# Altium schematic sheet INPUT_POWER.SchDoc
size A4; SheetNumber: 1; SheetTotal: 5
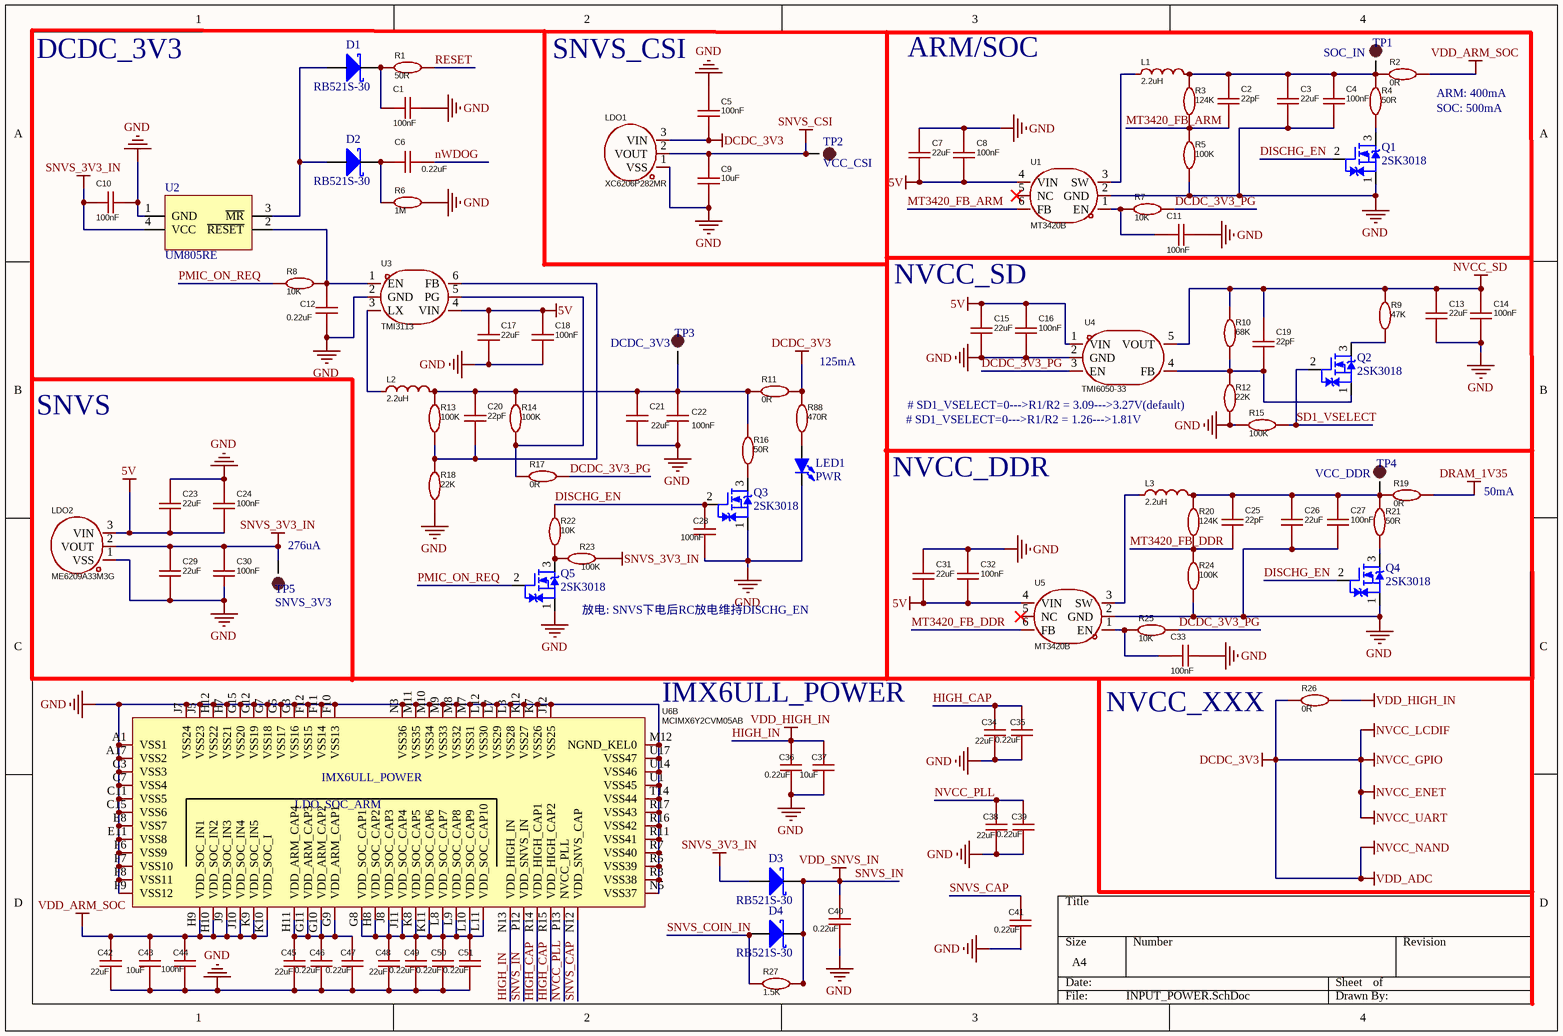
[diagram p0: INPUT_POWER.SchDoc]

## Parts
C1  100nF  [C0402]
C2  22pF  [C0402]
C3  22uF  [C0603]
C4  100nF  [C0402]
C5  100nF  [C0402]
C6  0.22uF  [C0402]
C7  22uF  [C0603]
C8  100nF  [C0402]
C9  10uF  [C0402]
C10  100nF  [C0402]
C11  100nF  [C0402]
C12  0.22uF  [C0402]
C13  22uF  [C0603]
C14  100nF  [C0402]
C15  22uF  [C0603]
C16  100nF  [C0402]
C17  22uF  [C0603]
C18  100nF  [C0402]
C19  22pF  [C0402]
C20  22pF  [C0402]
C21  22uF  [C0603]
C22  100nF  [C0402]
C23  22uF  [C0603]
C24  100nF  [C0402]
C25  22pF  [C0402]
C26  22uF  [C0603]
C27  100nF  [C0402]
C28  100nF  [C0402]
C29  22uF  [C0603]
C30  100nF  [C0402]
C31  22uF  [C0603]
C32  100nF  [C0402]
C33  100nF  [C0402]
C34  22uF  [C0603]
C35  0.22uF  [C0402]
C36  0.22uF  [C0402]
C37  10uF  [C0402]
C38  22uF  [C0603]
C39  0.22uF  [C0402]
C40  0.22uF  [C0402]
C41  0.22uF  [C0402]
C42  22uF  [C0603]
C43  10uF  [C0402]
C44  100nF  [C0402]
C45  22uF  [C0603]
C46  0.22uF  [C0402]
C47  0.22uF  [C0402]
C48  22uF  [C0603]
C49  0.22uF  [C0402]
C50  0.22uF  [C0402]
C51  0.22uF  [C0402]
D1  RB521S-30  [SOD-523]
D2  RB521S-30  [SOD-523]
D3  RB521S-30  [SOD-523]
D4  RB521S-30  [SOD-523]
L1  2.2uH  [IND-SMD_L2.5-W2.0_MHCHL2520]
L2  2.2uH  [IND-SMD_L2.5-W2.0_MHCHL2520]
L3  2.2uH  [IND-SMD_L2.5-W2.0_MHCHL2520]
LDO1  XC6206P282MR  [SOT-23-3_L2.9-W1.6-P1.90-LS2.8-BR]
LDO2  ME6209A33M3G  [SOT-23-3_L2.9-W1.6-P1.90-LS2.8-BR]
LED1  PWR  [LED 0603B]
Q1  2SK3018  [SC70-3N]
Q2  2SK3018  [SC70-3N]
Q3  2SK3018  [SC70-3N]
Q4  2SK3018  [SC70-3N]
Q5  2SK3018  [SC70-3N]
R1  50R  [R0402]
R2  0R  [R0402]
R3  124K  [R0402]
R4  50R  [R0402]
R5  100K  [R0402]
R6  1M  [R0402]
R7  10K  [R0402]
R8  10K  [R0402]
R9  47K  [R0402]
R10  68K  [R0402]
R11  0R  [R0402]
R12  22K  [R0402]
R13  100K  [R0402]
R14  100K  [R0402]
R15  100K  [R0402]
R16  50R  [R0402]
R17  0R  [R0402]
R18  22K  [R0402]
R19  0R  [R0402]
R20  124K  [R0402]
R21  50R  [R0402]
R22  10K  [R0402]
R23  100K  [R0402]
R24  100K  [R0402]
R25  10K  [R0402]
R26  0R  [R0402]
R27  1.5K  [R0402]
R88  470R  [R0402]
TP1  SOC_IN  [TP-1.0]
TP2  VCC_CSI  [TP-1.0]
TP3  DCDC_3V3  [TP-1.0]
TP4  VCC_DDR  [TP-1.0]
TP5  SNVS_3V3  [TP-1.0]
U1  MT3420B  [SOT-23-6_L2.9-W1.6-P0.95-LS2.8-BL]
U2  UM805RE  [SOT143]
U3  TMI3113  [SOT-23-6_L2.9-W1.6-P0.95-LS2.8-BL]
U4  TMI6050-33  [SOT-23-5_L2.9-W1.6-P0.95-LS2.8-BR]
U5  MT3420B  [SOT-23-6_L2.9-W1.6-P0.95-LS2.8-BL]
U6  MCIMX6Y2CVM05AB  [BGA-289_L14.0-W14.0-R17-C17-P0.80-BL]  (part B of 12)

## Nets
5V: C7.1 C8.1 C15.2 C16.2 C17.2 C18.2 C23.1 C24.1 C31.1 C32.1 LDO2.3(VIN) U1.4(VIN) U3.4(VIN) U4.1(VIN) U5.4(VIN)
DCDC_3V3: C5.2 LDO1.3(VIN) R11.2 R26.1 R88.2  [also labelled NVCC_ENET, NVCC_GPIO, NVCC_LCDIF, NVCC_NAND, NVCC_UART, VDD_ADC]
DRAM_1V35: R19.2
GND: C1.1 C3.1 C4.1 C5.1 C7.2 C8.2 C9.1 C10.1 C11.1 C12.2 C13.1 C14.1 C15.1 C16.1 C17.1 C18.1 C21.1 C22.1 C23.2 C24.2 C26.1 C27.1 C28.1 C29.1 C30.1 C31.2 C32.2 C33.1 C34.1 C35.1 C36.1 C37.1 C38.1 C39.1 C40.1 C41.1 C42.1 C43.1 C44.1 C45.1 C46.1 C47.1 C48.1 C49.1 C50.1 C51.1 LDO1.1(VSS) LDO2.1(VSS) LED1.2(K) Q1.1(S) Q3.1(S) Q4.1(S) Q5.1(S) R5.2 R6.2 R12.2 R15.1 R18.1 R24.2 U1.2(GND) U2.1(GND) U3.2(GND) U4.2(GND) U5.2(GND) U6.A1(VSS1) U6.A17(VSS2) U6.C3(VSS3) U6.C7(VSS4) U6.C11(VSS5) U6.C15(VSS6) U6.E8(VSS7) U6.E11(VSS8) U6.F6(VSS9) U6.F7(VSS10) U6.F8(VSS11) U6.F9(VSS12) U6.F10(VSS13) U6.F11(VSS14) U6.F12(VSS15) U6.G3(VSS16) U6.G5(VSS17) U6.G7(VSS18) U6.G12(VSS19) U6.G15(VSS20) U6.H7(VSS21) U6.H12(VSS22) U6.J5(VSS23) U6.J7(VSS24) U6.J12(VSS25) U6.K7(VSS26) U6.K12(VSS27) U6.L3(VSS28) U6.L7(VSS29) U6.L12(VSS30) U6.M7(VSS31) U6.M8(VSS32) U6.M9(VSS33) U6.M10(VSS34) U6.M11(VSS35) U6.M12(NGND_KEL0) U6.N3(VSS36) U6.N5(VSS37) U6.R3(VSS38) U6.R5(VSS39) U6.R7(VSS40) U6.R11(VSS41) U6.R16(VSS42) U6.R17(VSS43) U6.T14(VSS44) U6.U1(VSS45) U6.U14(VSS46) U6.U17(VSS47)
HIGH_IN: C36.2 C37.2 R26.2 U6.N13(VDD_HIGH_IN)  [also labelled VDD_HIGH_IN]
NVCC_SD: C13.2 C14.2 C19.2 R9.2 R10.1 U4.5(VOUT)
SNVS_3V3_IN: C10.2 C29.2 C30.2 D3.1(A) LDO2.2(VOUT) R23.1 TP5.1 U2.4(VCC)
SNVS_CSI: C9.2 LDO1.2(VOUT) TP2.1
SNVS_IN: C40.2 D3.2(C) D4.2(C) R27.1 U6.P12(VDD_SNVS_IN)  [also labelled VDD_SNVS_IN]
VDD_ARM_SOC: C42.2 C43.2 C44.2 R2.2 U6.H9(VDD_SOC_IN1) U6.H10(VDD_SOC_IN2) U6.J9(VDD_SOC_IN3) U6.J10(VDD_SOC_IN4) U6.K9(VDD_SOC_IN5) U6.K10(VDD_SOC_I)
DCDC_3V3_PG: R7.1 R17.2 R25.1 U4.3(EN)
DISCHG_EN: C28.2 Q1.2(G) Q3.2(G) Q4.2(G) R22.2
HIGH_CAP: C34.2 C35.2 U6.R14(VDD_HIGH_CAP1) U6.R15(VDD_HIGH_CAP2)
MT3420_FB_ARM: C2.1 R3.2 R5.1 U1.6(FB)
MT3420_FB_DDR: C25.1 R20.2 R24.1 U5.6(FB)
NVCC_PLL: C38.2 C39.2 U6.P13(NVCC_PLL)
nWDOG: C6.1
PMIC_ON_REQ: Q5.2(G) R8.1
RESET: R1.2
SD1_VSELECT: Q2.2(G) R15.2
SNVS_CAP: C41.2 U6.N12(VDD_SNVS_CAP)
SNVS_COIN_IN: D4.1(A) R27.2
NetC1_2: C1.2 D1.2(C) R1.1
NetC2_2: C2.2 C3.2 C4.2 L1.2 R2.1 R3.1 R4.2 TP1.1
NetC6_2: C6.2 D2.2(C) R6.1
NetC11_2: C11.2 R7.2 U1.1(EN)
NetC12_1: C12.1 R8.2 U2.2(~{RESET}) U3.1(EN)
NetC19_1: C19.1 Q2.1(S) R10.2 R12.1 U4.4(FB)
NetC20_1: C20.1 C21.2 C22.2 L2.2 R11.1 R13.2 R14.1 R16.2 TP3.1
NetC20_2: C20.2 R13.1 R18.2 U3.6(FB)
NetC25_2: C25.2 C26.2 C27.2 L3.2 R19.1 R20.1 R21.2 TP4.1
NetC33_2: C33.2 R25.2 U5.1(EN)
NetC45_2: C45.2 C46.2 C47.2 U6.G9(VDD_ARM_CAP1) U6.G10(VDD_ARM_CAP2) U6.G11(VDD_ARM_CAP3) U6.H11(VDD_ARM_CAP4)
NetC48_2: C48.2 C49.2 C50.2 C51.2 U6.G8(VDD_SOC_CAP1) U6.H8(VDD_SOC_CAP2) U6.J8(VDD_SOC_CAP3) U6.J11(VDD_SOC_CAP4) U6.K8(VDD_SOC_CAP5) U6.K11(VDD_SOC_CAP6) U6.L8(VDD_SOC_CAP7) U6.L9(VDD_SOC_CAP8) U6.L10(VDD_SOC_CAP9) U6.L11(VDD_SOC_CAP10)
NetD1_1: D1.1(A) D2.1(A) U2.3(~{MR})
NetL1_1: L1.1 U1.3(SW)
NetL2_1: L2.1 U3.3(LX)
NetL3_1: L3.1 U5.3(SW)
NetLED1_1: LED1.1(A) R88.1
NetQ1_3: Q1.3(D) R4.1
NetQ2_3: Q2.3(D) R9.1
NetQ3_3: Q3.3(D) R16.1
NetQ4_3: Q4.3(D) R21.1
NetQ5_3: Q5.3(D) R22.1 R23.2
NetR14_2: R14.2 R17.1 U3.5(PG)

Not connected (* = marked no-connect by the designer): U1 5(NC)*; U5 5(NC)*

## Notes on the sheet
- DCDC_3V3
- SNVS_CSI
- ARM/SOC
- (near R2) ARM: 400mA
- (near R2) SOC: 500mA
- NVCC_SD
- 125mA
- SNVS
- # SD1_VSELECT=0--->R1/R2 = 1.26--->1.81V
- # SD1_VSELECT=0--->R1/R2 = 3.09--->3.27V(default)
- NVCC_DDR
- 50mA
- (near TP5) 276uA
- (near Q5) 放电: SNVS下电后RC放电维持DISCHG_EN
- (near U6) IMX6ULL_POWER
- (near C33) NVCC_XXX
- (in symbol MCIMX6Y2CVM05AB, part B) IMX6ULL_POWER; LDO_SOC_ARM

## Library data of the parts
C1 C4 C5 C8 C10 C11 C14 C16 C18 C22 C24 C27 C28 C30 C32 C33 C44 = C0402: 容值:100nF;精度:±10%;额定电压:50V;材质(温度系数):X7R;; Manufacturer: muRata(村田); Symbol: GRM155R71H104KE14D; Add into BOM: yes; Tolerance: ±10%; Voltage Rated: 50V; Temperature Coefficient: X7R; Device: GRM155R71H104KE14D; LCSC Part Name: 100nF ±10% 50V; Supplier Part: C77020; Manufacturer Part: GRM155R71H104KE14D; Supplier Footprint: 0402; JLCPCB Part Class: 扩展库; Datasheet: https://atta.szlcsc.com/upload/public/pdf/source/20180326/C77020_39BD49C951FF1AF0DB1F1FAC5AC1E401.pdf; Supplier: LCSC; Convert to PCB: yes; Value: 100nF
C2 C6 C9 C12 C19 C20 C25 C35-C37 C39-C41 C43 C46 C47 C49-C51 = C0402: 容值:100nF;精度:±10%;额定电压:50V;材质(温度系数):X7R;; Manufacturer: muRata(村田); Symbol: GRM155R71H104KE14D; Add into BOM: yes; Value: 100nF; Tolerance: ±10%; Voltage Rated: 50V; Temperature Coefficient: X7R; Device: GRM155R71H104KE14D; LCSC Part Name: 100nF ±10% 50V; Supplier Part: C77020; Manufacturer Part: GRM155R71H104KE14D; Supplier Footprint: 0402; JLCPCB Part Class: 扩展库; Datasheet: https://atta.szlcsc.com/upload/public/pdf/source/20180326/C77020_39BD49C951FF1AF0DB1F1FAC5AC1E401.pdf; Supplier: LCSC; Convert to PCB: yes
C3 C7 C13 C15 C17 C21 C23 C26 C29 C31 C34 C38 C42 C45 C48 = C0603: 容值:22uF;精度:±20%;额定电压:10V;材质(温度系数):X5R;; Manufacturer: Chinocera(华瓷); Symbol: HGC0603R5226M100NTHJ; Add into BOM: yes; Tolerance: ±20%; Voltage Rated: 10V; Temperature Coefficient: X5R; Device: HGC0603R5226M100NTHJ; LCSC Part Name: 22uF ±20% 10V; Supplier Part: C7432770; Manufacturer Part: HGC0603R5226M100NTHJ; Supplier Footprint: 0603; JLCPCB Part Class: 扩展库; Datasheet: https://atta.szlcsc.com/upload/public/pdf/source/20240320/FAC3FEC40A78BC5CCCE96C232A94D860.pdf; Supplier: LCSC; Convert to PCB: yes; Value: 22uF
L1-L3 = L2.5_SMD: 电感值:2.2uH;精度:±20%;额定电流:3A;饱和电流(Isat):3.8A;类型:一体成型电感;; Manufacturer: cjiang(长江微电); Symbol: FTC252012S2R2MBCA; Add into BOM: yes; Tolerance: ±20%; Rated Current: 3A; Saturation Current (Isat): 3.8A; DC Resistance (DCR): 55mΩ; Type: 一体成型电感; Device: FTC252012S2R2MBCA; LCSC Part Name: 2.2uH ±20% 3.8A; Supplier Part: C5832372; Manufacturer Part: FTC252012S2R2MBCA; Supplier Footprint: 1008; JLCPCB Part Class: 扩展库; Datasheet: https://atta.szlcsc.com/upload/public/pdf/source/20230602/8FFEDA9C0247A92A0D4B67554BFE4091.pdf; Supplier: LCSC; Convert to PCB: yes; Value: 2.2uH
LDO1 = XC6206P282MR: 输出类型:固定;最大输入电压:6V;输出电压:3.3V;最大输出电流:250mA;电源纹波抑制比(PSRR):-;输出极性:正极;; Manufacturer: MICRONE(南京微盟); Symbol: ME6209A33M3G; Add into BOM: yes; Output Type: 固定; Maximum Input Voltage: 18V; Output Voltage: 3.3V; MAX Output Current: 250mA; Dropout Voltage: 80mV@(40mA); Output Polarity: 正极; Number of Outputs: 1; Device: ME6209A33M3G; LCSC Part Name: 输入18V 输出3.3V 250mA; Supplier Part: C83508; Manufacturer Part: ME6209A33M3G; Supplier Footprint: SOT-23-3L; JLCPCB Part Class: 扩展库; Datasheet: https://atta.szlcsc.com/upload/public/pdf/source/20161212/1481539101152.pdf; Supplier: LCSC; Convert to PCB: yes; Power Supply Rejection Ratio (PSRR): -
LDO2 = ME6209A33M3G: 输出类型:固定;最大输入电压:18V;输出电压:3.3V;最大输出电流:250mA;电源纹波抑制比(PSRR):-;输出极性:正极;; Manufacturer: MICRONE(南京微盟); Add into BOM: yes; Output Type: 固定; Maximum Input Voltage: 18V; Output Voltage: 3.3V; MAX Output Current: 250mA; Dropout Voltage: 80mV@(40mA); Output Polarity: 正极; Number of Outputs: 1; Symbol: ME6209A33M3G; Device: ME6209A33M3G; LCSC Part Name: 输入18V 输出3.3V 250mA; Supplier Part: C83508; Manufacturer Part: ME6209A33M3G; Supplier Footprint: SOT-23-3L; JLCPCB Part Class: 扩展库; Datasheet: https://atta.szlcsc.com/upload/public/pdf/source/20161212/1481539101152.pdf; Supplier: LCSC; Convert to PCB: yes; Power Supply Rejection Ratio (PSRR): -
LED1 = LED-SMD: 贴片LED; 版权归属: 源创客; BOM名称: 贴片LED; 学习资源: www.ooocke.com
Q1-Q5 = 2SK3018: N沟场效应管  30V,0.1A; 版权归属: 源创客; BOM名称: N沟场效应管; 学习资源: www.ooocke.com
R1-R27 R88 = R0402: 电阻类型:厚膜电阻;阻值:1kΩ;精度:±1%;功率:62.5mW;最大工作电压:50V;温度系数:±100ppm/℃;; Manufacturer: UNI-ROYAL(厚声); Symbol: 0402WGF1001TCE; Add into BOM: yes; Value: 1kΩ; Tolerance: ±1%; Power(Watts): 62.5mW; Overload Voltage (Max): 50V; Device: 0402WGF1001TCE; LCSC Part Name: 1kΩ ±1% 62.5mW 厚膜电阻; Supplier Part: C11702; Manufacturer Part: 0402WGF1001TCE; Supplier Footprint: 0402; JLCPCB Part Class: 基础库; Datasheet: https://atta.szlcsc.com/upload/public/pdf/source/20200306/C422600_1E6D84923E4A46A82E41ADD87F860B5C.pdf; Supplier: LCSC; Convert to PCB: yes; Type: 厚膜电阻; Temperature Coefficient: ±100ppm/℃; Operating Temperature Range: -55℃~+155℃
TP1-TP5 = TEST-POINT: 测试点
U1 U5 = MT3420B: 功能类型:降压型;输出类型:可调;输入电压:2.3V~6V;输出电流:2A;; Manufacturer: 西安航天民芯; Add into BOM: yes; Function: 降压型; Output Type: 可调; Output Current: 2A; Switching Frequency: 1.5MHz; Synchronous Rectification: 是; Number of Outputs: 1; Topology: 降压式; Quiescent Current (Iq): 40uA; Switch tube (built-in/external): 内置; Symbol: MT3420B; Device: MT3420B; LCSC Part Name: 高效率1.5MHz 2A同步降压转换器; Supplier Part: C88169; Manufacturer Part: MT3420B; Supplier Footprint: SOT-23-6; JLCPCB Part Class: 扩展库; Datasheet: https://atta.szlcsc.com/upload/public/pdf/source/20161118/1479432899451.pdf; Supplier: LCSC; Convert to PCB: yes; Input Voltage: 2.3V~6V; Operating Temperature: -40℃~+85℃
U3 = TMI3113: Manufacturer: TMI(拓尔微); Add into BOM: yes; Symbol: TMI3113; Device: TMI3113; LCSC Part Name: 降压电源IC; Supplier Part: C840538; Manufacturer Part: TMI3113; Supplier Footprint: SOT-23-6; JLCPCB Part Class: 扩展库; Datasheet: https://atta.szlcsc.com/upload/public/pdf/source/20240703/C0AA5197CCC5F744B98CE85D643249DC.pdf; Supplier: LCSC; Convert to PCB: yes
U4 = TMI6050-33: 输出类型:-;; Manufacturer: TMI(拓尔微); Add into BOM: yes; Symbol: TMI6050-33; Device: TMI6050-33; LCSC Part Name: TMI6050-33; Supplier Part: C911079; Manufacturer Part: TMI6050-33; Supplier Footprint: SOT-23-5; JLCPCB Part Class: 扩展库; Datasheet: https://atta.szlcsc.com/upload/public/pdf/source/20201021/C883398_061EBE8A1966023595B0BA10A4DBC8BC.pdf; Supplier: LCSC; Convert to PCB: yes; Output Type: -
U6 = MCIMX6Y2CVM05AB: CPU内核:ARM-A系列;RAM总容量:128KB;GPIO端口数量:-;工作电压范围:-;CPU最大主频:528MHz;程序存储器类型:-;应用领域:-;; Manufacturer: NXP(恩智浦); Add into BOM: yes; RAM Size: 128KB; CPU Maximum Speed: 528MHz; ADC (Bit): 12bit; UART/USART: 8; I2C: 4; Universal Serial Bus: 有; Peripheral/Function: 真随机数发生器; Symbol: MCIMX6Y2CVM05AB; Device: MCIMX6Y2CVM05AB; LCSC Part Name: MCIMX6Y2CVM05AB; Supplier Part: C394783; Manufacturer Part: MCIMX6Y2CVM05AB; Supplier Footprint: MAPBGA-289(14x14); JLCPCB Part Class: 扩展库; Datasheet: https://atta.szlcsc.com/upload/public/pdf/source/20190903/C414057_F91A491E37DFDD32A6FE61E7D0CA74B1.pdf; Supplier: LCSC; Convert to PCB: yes; CPU Core: ARM-A系列; GPIO Ports Number: -; Operating Voltage Range: -; Program Memory Type: -; Operating Temperature Range: -40℃~+105℃; DAC (Bit): -; PWM (Bit): -; 8Bit Timer: -; 16Bit Timer: -; 32Bit Timer: -; CAN: -; I2S: -; SPI: 4; Internal Comparator: -; communication protocol: -; Watchdog: -; Real-Time Clock: -; Infrared Data Association: -; Low-Voltage Detect: -; CCP Capture/Compare: -; LCD Module: 有; LED Module: -; Secure Digital Input and Output: -; Direct Memory Access: -; Internal Oscillator: -; Application Area: -